# EAGLE design V1 (EAGLE 8.5.1)
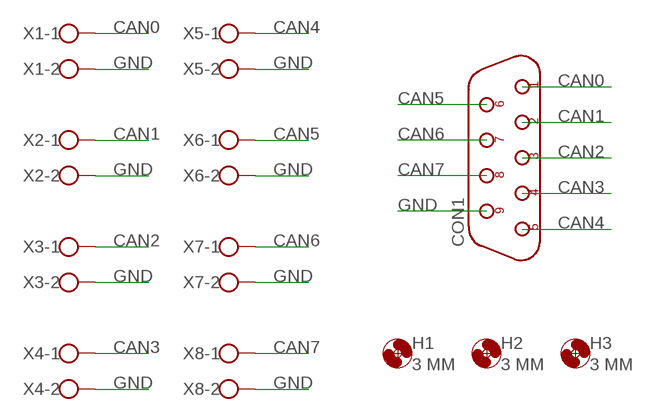
[diagram p0: schematic, sheet 1]

## Parts
CON1  DB9F/90  [D-09F/90]
H1  3 MM  MOUNT-HOLE3.0  [3,0]
H2  3 MM  MOUNT-HOLE3.0  [3,0]
H3  3 MM  MOUNT-HOLE3.0  [3,0]
X1  W237-102  [W237-102]
X2  W237-102  [W237-102]
X3  W237-102  [W237-102]
X4  W237-102  [W237-102]
X5  W237-102  [W237-102]
X6  W237-102  [W237-102]
X7  W237-102  [W237-102]
X8  W237-102  [W237-102]

## Nets
CAN0: CON1.1 X1.1
CAN1: CON1.2 X2.1
CAN2: CON1.3 X3.1
CAN3: CON1.4 X4.1
CAN4: CON1.5 X5.1
CAN5: CON1.6 X6.1
CAN6: CON1.7 X7.1
CAN7: CON1.8 X8.1
GND: CON1.9 X1.2 X2.2 X3.2 X4.2 X5.2 X6.2 X7.2 X8.2

## Library data of the parts
CON1 = connect:DB9F/90
H1-H3 = holes:MOUNT-HOLE: MOUNTING HOLE with drill center marker
X1-X8 = con-wago-500:W237-102: WAGO SCREW CLAMP; MPN: 237-102; OC_FARNELL: unknown; OC_NEWARK: 70K9898

## Board
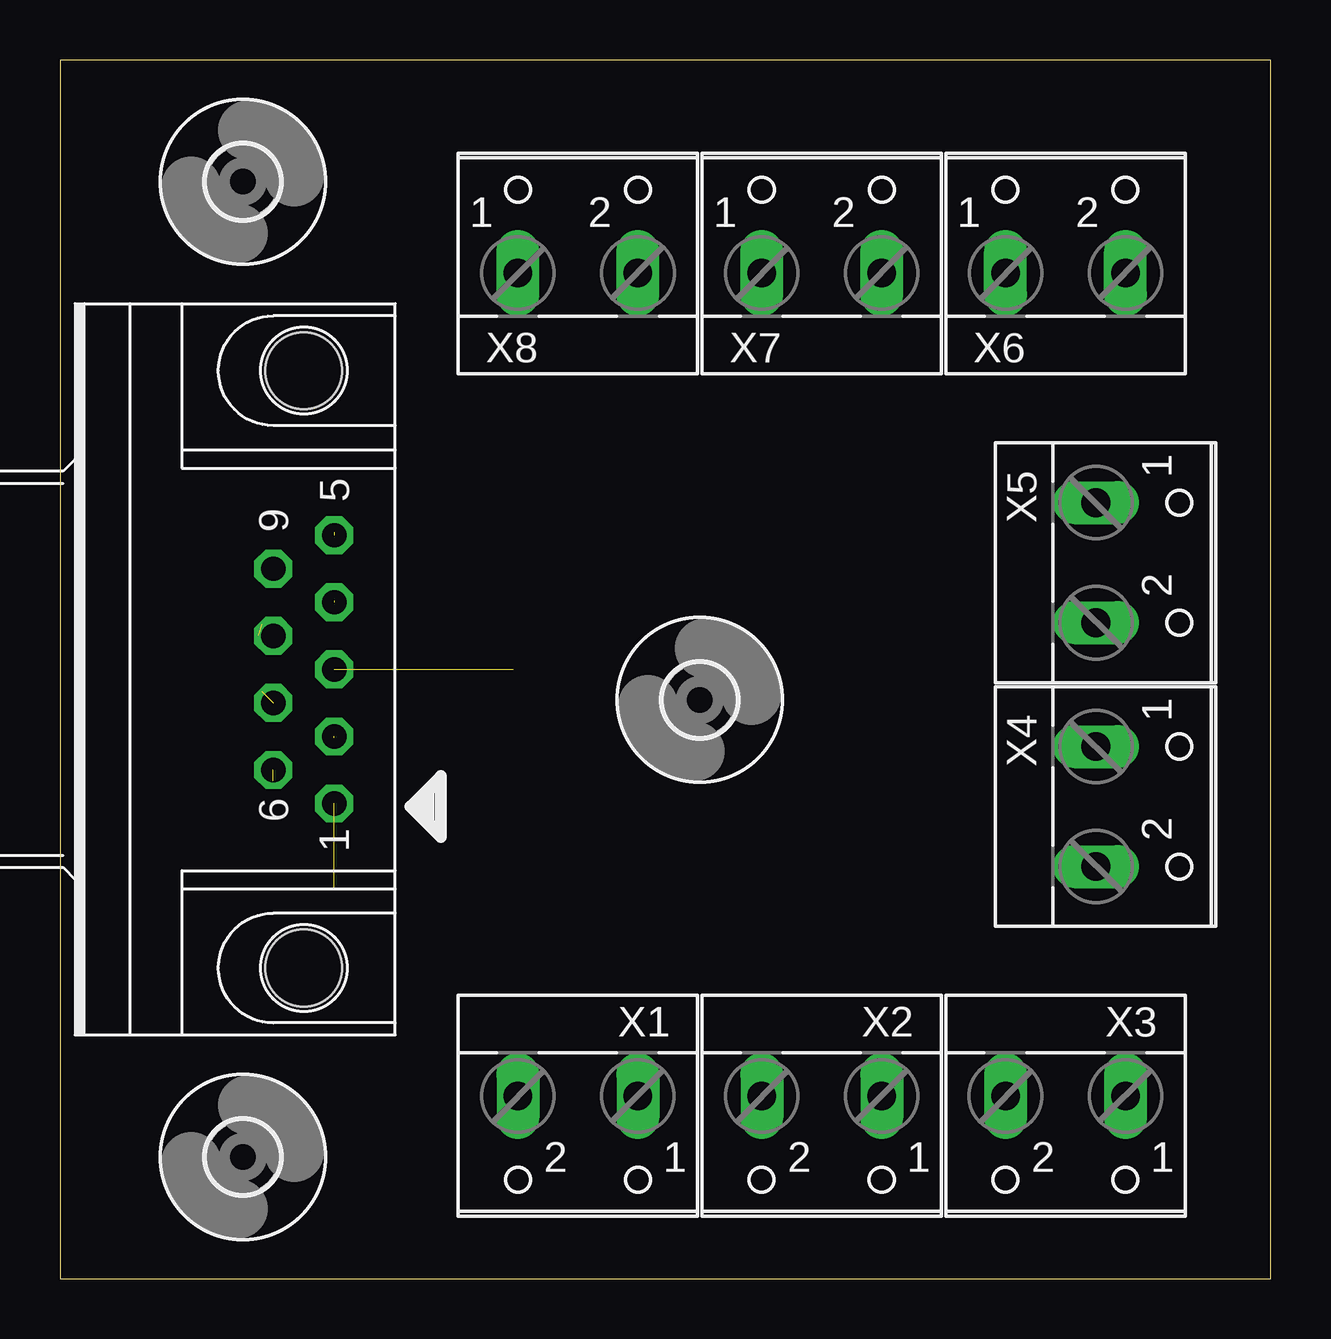
[diagram p1: board, top side]
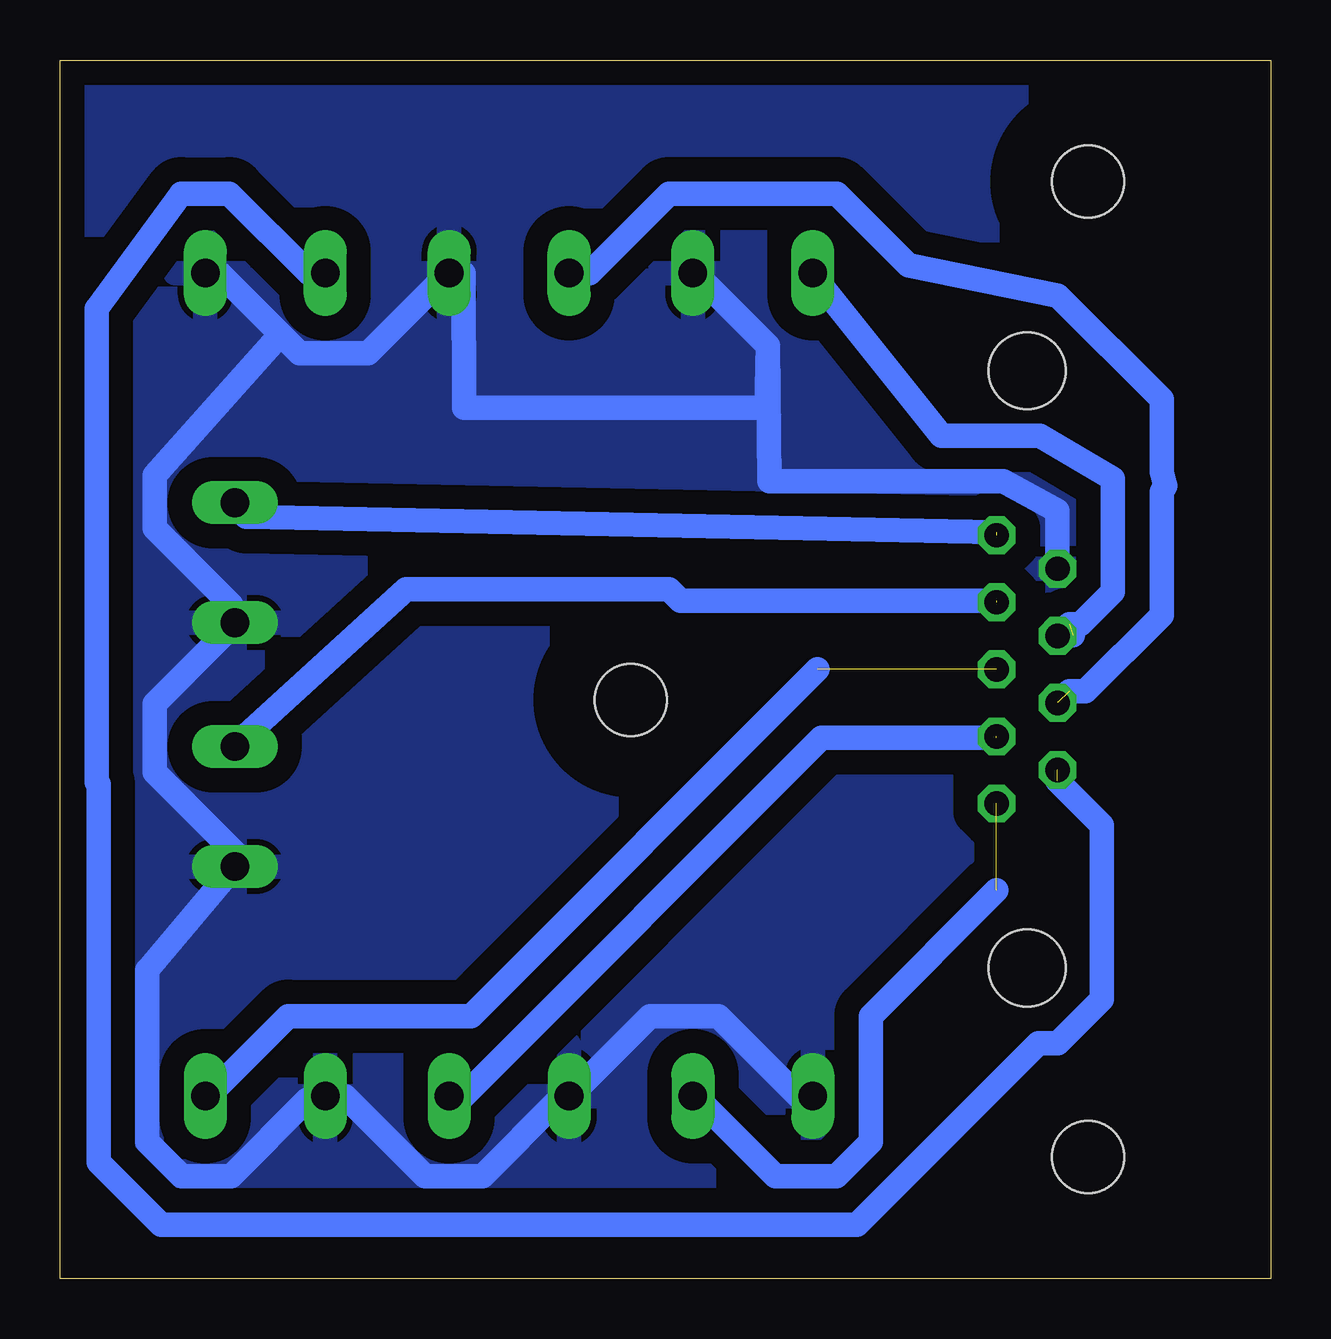
[diagram p2: board, bottom side, seen from below]

Size 50.47 x 50.79 mm. Coordinates in mm from the lower left corner, seen from the top.
Outline: 0,0 50.47,0 50.47,50.79 0,50.79 0,0
Copper layers (1*16): Top 0.035mm / dielectric 1.5mm / Bottom 0.035mm
Design rules "default *": minimum track width 40mil, minimum drill 0.35mm, track to track 40mil, track to pad 40mil, pad to pad 6mil, via to via 6mil, smd to smd 6mil, copper to edge 40mil, drill to drill 6mil, minimum pad ring 10mil, minimum via ring 8mil, stop-mask expansion 4mil, vias tented up to drill 0mil, thermal gap 10mil

### Footprints (pad centres in the part's own frame; a part is rotated, then mirrored left to right if it is on the bottom)
D-09F/90 = drill 1.016 pad 1.575 octagon: 1 -5.588,-1.27; 2 -2.794,-1.27; 3 0,-1.27; 4 2.794,-1.27; 5 5.588,-1.27; 6 -4.191,1.27; 7 -1.397,1.27; 8 1.397,1.27; 9 4.191,1.27 | hole 3.2: 12.446,0; -12.446,0
3,0 = hole 3: 0,0
W237-102 = drill 1.194 long: 1 -2.5,-1.27; 2 2.5,-1.27

### Placement (x,y rotation side)
CON1  10.16,25.4 90 top
H1  26.67,24.13 0 top
H2  7.62,45.72 0 top
H3  7.62,5.08 0 top
X1  21.59,6.35 180 top
X2  31.75,6.35 180 top
X3  41.91,6.35 180 top
X4  44.45,19.68 270 top
X5  44.45,29.84 270 top
X6  41.91,43.18 0 top
X7  31.75,43.18 0 top
X8  21.59,43.18 0 top

### Tracks (layer width: path | path; a pad name or v marks a point on that pad's centre or on a via)
CAN0  (1 unrouted)
  Bottom 1.016: 11.43,16.19 16.67,10.95 16.67,5.71 18.1,4.29 20.64,4.29 23.97,7.62 X1.1
CAN1  (1 unrouted)
  Bottom 1.016: 11.43,22.54 18.73,22.54 33.66,7.62 X2.1
CAN2  (1 unrouted)
  Bottom 1.016: 18.89,25.4 33.34,10.95 40.96,10.95 44.29,7.62 X3.1
CAN3  (1 unrouted)
  Bottom 1.016: 11.43,28.26 24.61,28.26 25.08,28.73 36.04,28.73 43.18,22.23 X4.1
CAN4  (1 unrouted)
  Bottom 1.016: 11.43,31.11 42.7,31.75 43.18,32.23 X5.1
CAN5  (1 unrouted)
  Bottom 1.016: 8.89,20.75 7.04,18.9 7.04,11.66 8.87,9.83 9.68,9.83 17.26,2.25 46.24,2.25 48.86,4.87 48.86,20.62 48.95,20.7 48.95,40.42 45.41,45.23 43.41,45.23 40.09,41.91 X6.1
CAN6  (1 unrouted)
  Bottom 1.016: X7.1 28.41,41.91 25.09,45.23 18.09,45.23 15.1,42.24 8.87,40.97 4.55,36.65 4.55,33.61 4.4,33.05 4.55,32.8 4.55,27.66 7.72,24.49 8.41,24.49
CAN7  (1 unrouted)
  Bottom 1.016: 8.26,26.83 8.89,26.83 CON1.8 | 8.41,27.28 7.93,27.28 6.58,28.63 6.58,33.35 9.63,35.13 13.74,35.13 19.15,41.91 X8.1
GND
  Bottom 1.016: X1.2 19.68,7.62 23.02,10.95 25.88,10.95 29.21,7.62 X2.2 29.69,7.46 32.86,4.29 35.24,4.29 38.58,7.62 X3.2 39.85,7.46 40.16,7.46 43.34,4.29 45.4,4.29 46.83,5.71 46.83,12.86 43.5,16.83 X4.2 43.18,17.78 46.51,21.11 46.51,23.97 43.18,27.3 X5.2 43.34,27.78 43.34,28.1 46.51,31.27 46.51,33.5 41.27,39.37 | CON1.9 8.89,32 11.14,33.24 20.89,33.24 20.95,38.89 | 20.95,38.89 23.97,41.91 X8.2 | 20.95,38.89 21.02,36.29 33.62,36.29 33.66,41.91 X7.2 34.61,41.59 37.62,38.58 40.48,38.58 41.27,39.37 | X6.2 43.81,41.91 41.27,39.37
  pour Bottom: 0.25,50.55 50.04,50.55 50.29,50.29 50.29,0 -0.25,0 0,0.25 0,50.8